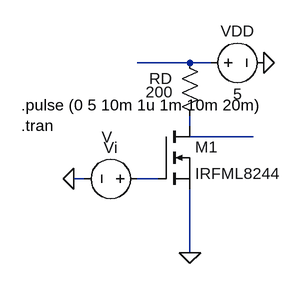
[diagram p0: schematic 3.3.1.asc]
3.3.1.asc, the LTspice schematic file:
Version 4
SHEET 1 880 680
WIRE 384 240 304 240
WIRE 416 240 384 240
WIRE 384 336 384 320
WIRE 480 352 384 352
WIRE 224 416 208 416
WIRE 336 416 304 416
WIRE 384 528 384 432
FLAG 384 528 0
FLAG 208 416 0
FLAG 496 240 0
SYMBOL Voltage 320 416 R90
WINDOW 0 -32 56 VBottom 2
WINDOW 3 -79 62 VTop 2
SYMATTR InstName Vi
SYMBOL nmos 336 336 R0
SYMATTR InstName M1
SYMATTR Value IRFML8244
SYMBOL Res 368 224 R0
WINDOW 0 -46 40 Left 2
WINDOW 3 -51 61 Left 2
SYMATTR InstName RD
SYMATTR Value 200
SYMBOL Voltage 400 240 R270
WINDOW 0 32 56 VTop 2
WINDOW 3 -32 56 VBottom 2
SYMATTR InstName VDD
SYMATTR Value 5
TEXT 128 304 Left 2 !.pulse (0 5 10m 1u 1m 10m 20m)\n.tran

The netlist it stands for:
* 3.3.1.asc
Vi N004 0 V
M1 N002 N004 0 0 IRFML8244
RD N001 N002 200
VDD N001 0 5
.model NMOS NMOS
.model PMOS PMOS
.lib standard.mos
.pulse (0 5 10m 1u 1m 10m 20m)
.tran
.backanno
.end